# EAGLE schematic stream_i-o_2_3 (EAGLE 7.5.0)

## Sheet 1 of 2
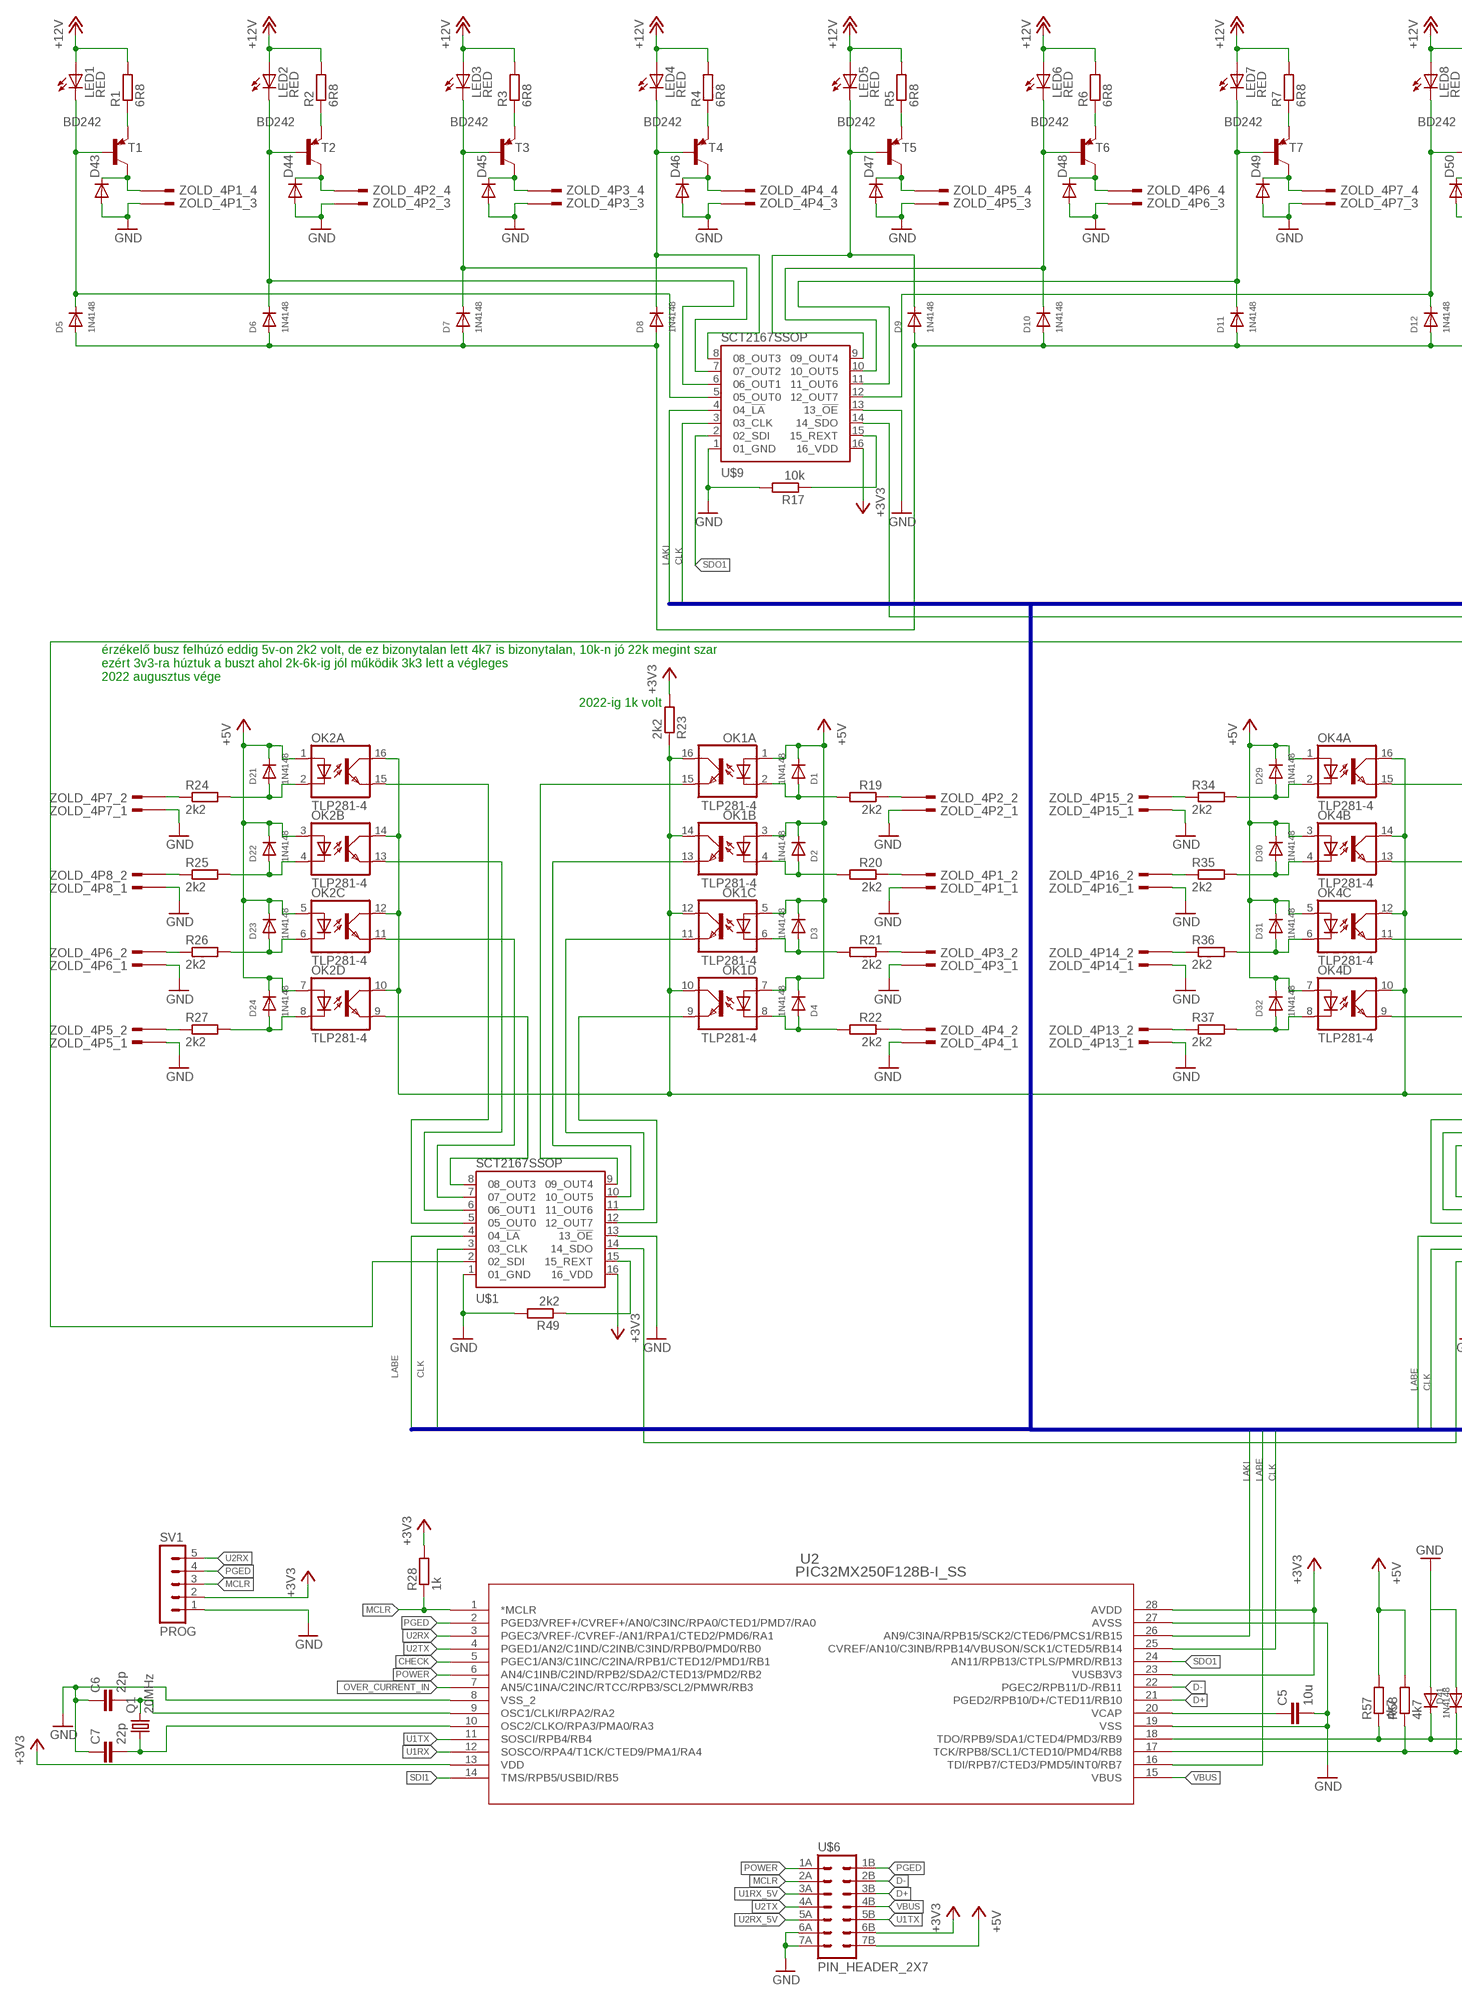
[diagram p0: schematic, sheet 1, part 1 of 2]
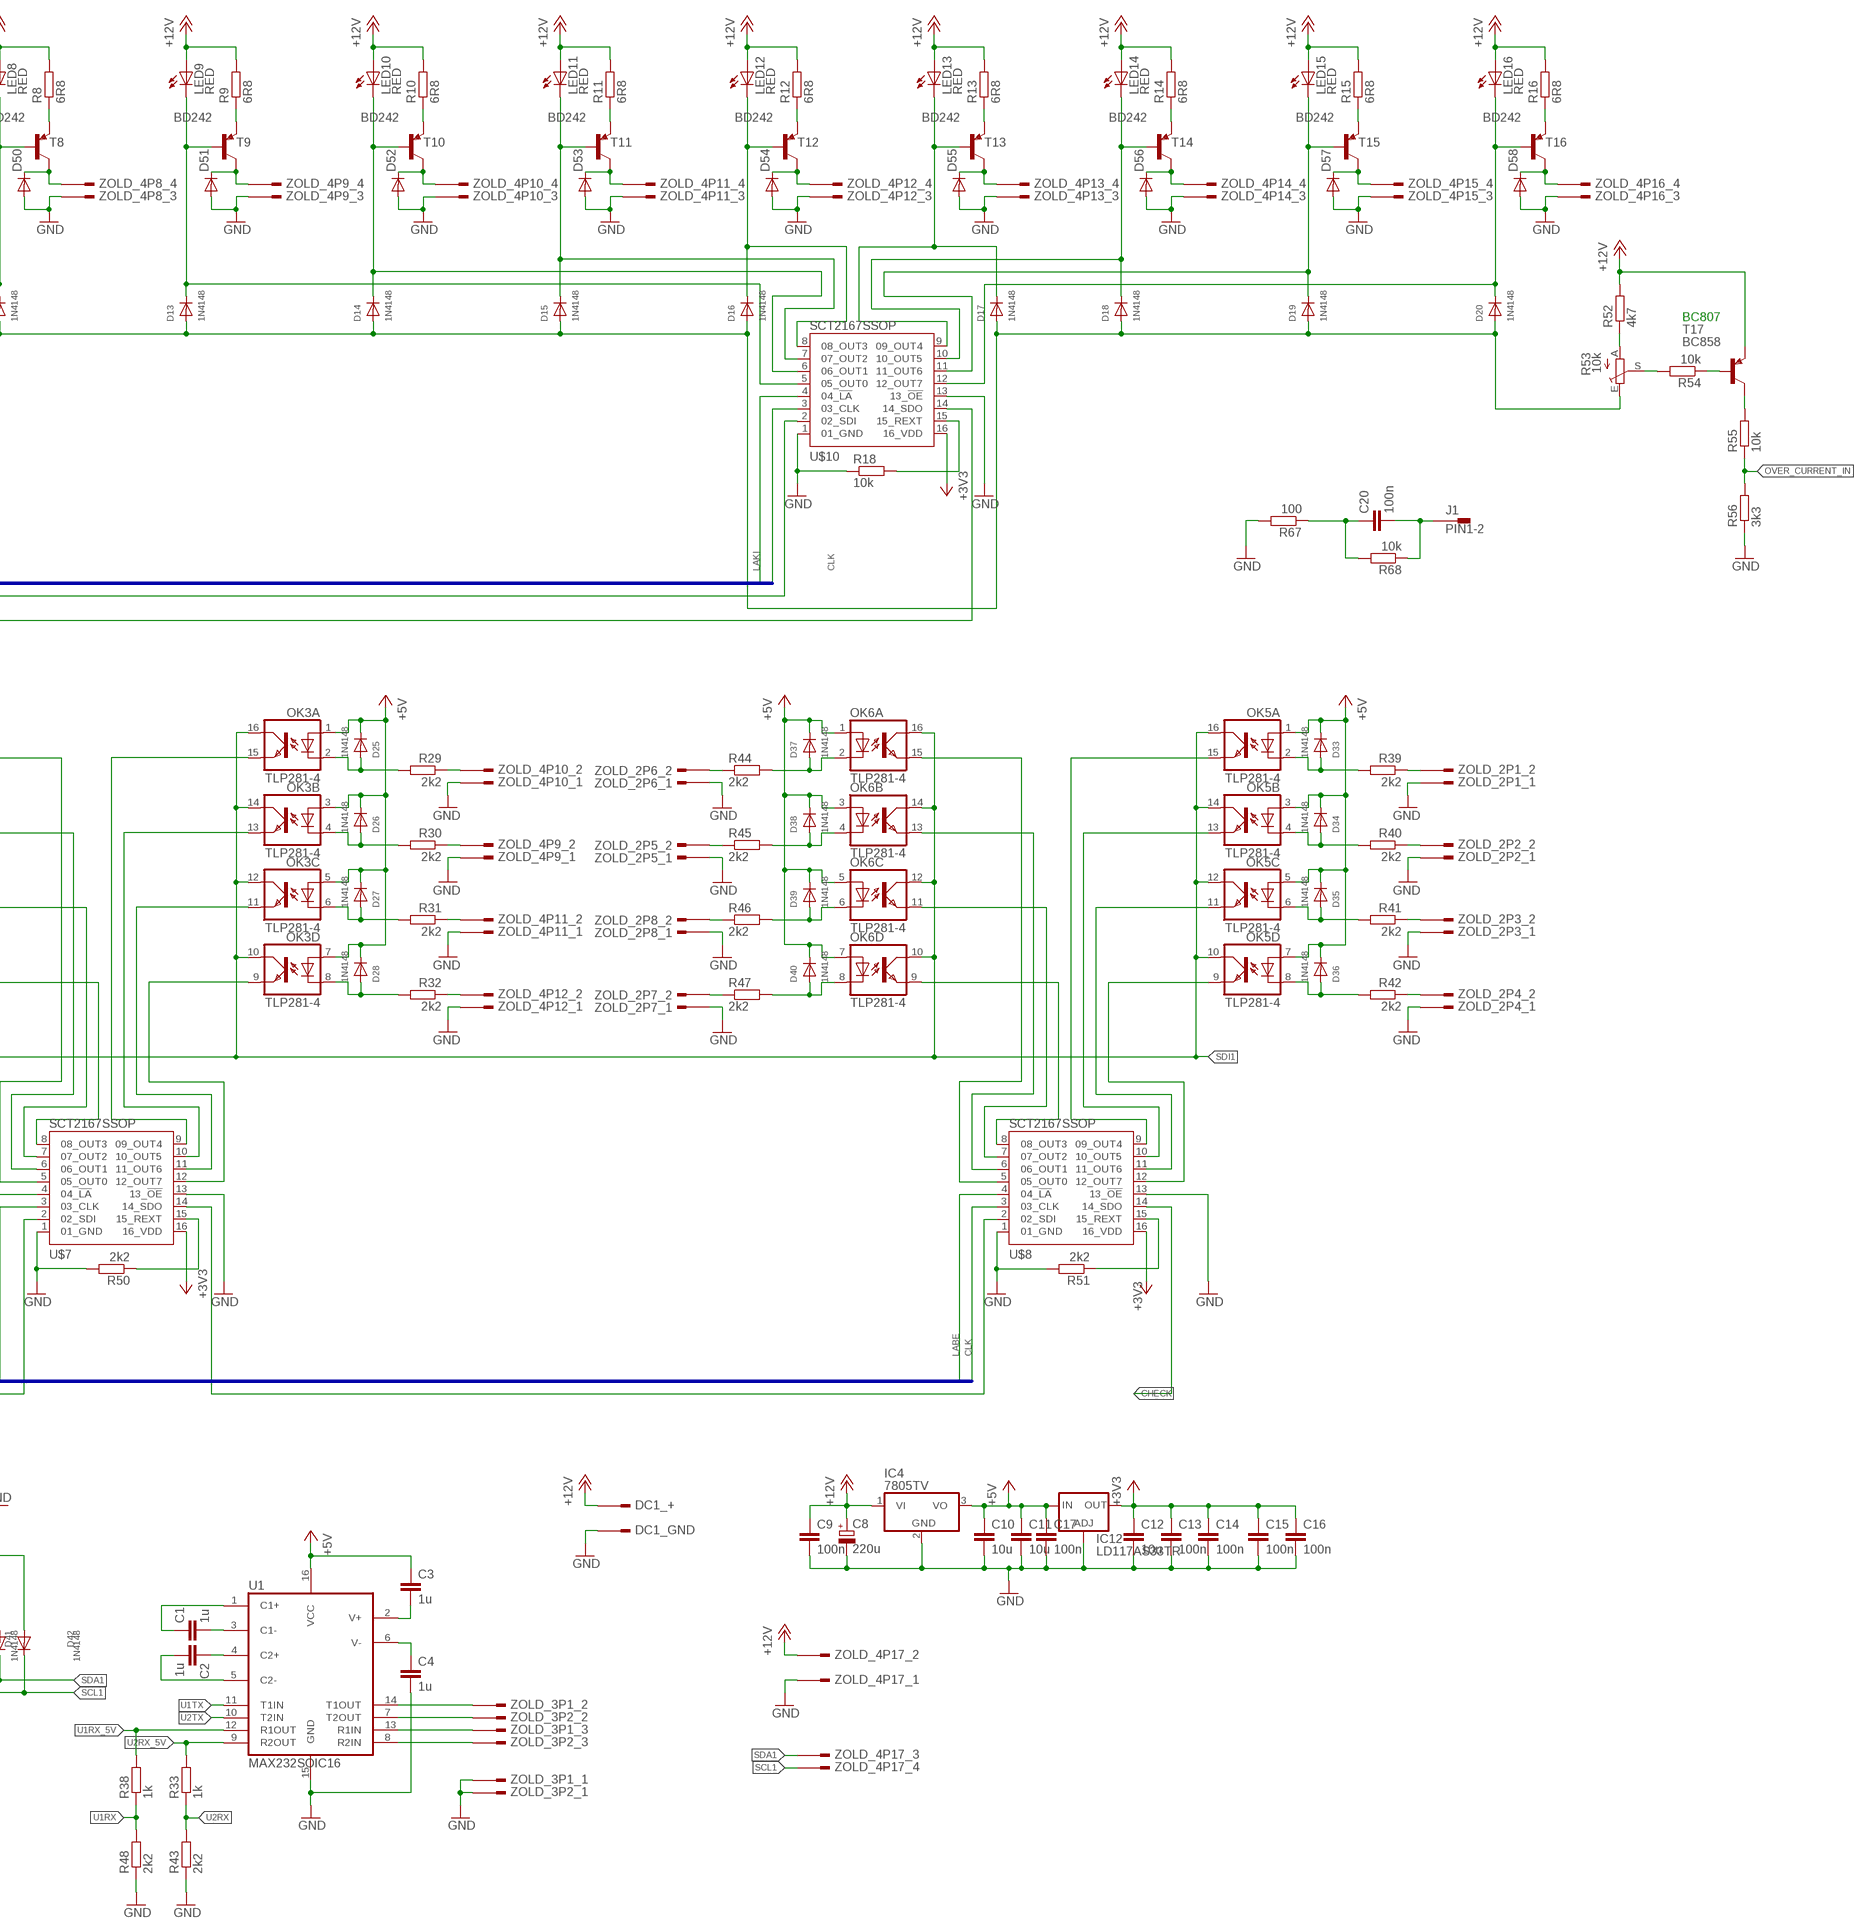
[diagram p1: schematic, sheet 1, part 2 of 2]

### Parts
C1  1u  C-EUC0805  [C0805]
C2  1u  C-EUC0805  [C0805]
C3  1u  C-EUC0805  [C0805]
C4  1u  C-EUC0805  [C0805]
C5  10u  C-EUC0805  [C0805]
C6  22p  C-EUC0805  [C0805]
C7  22p  C-EUC0805  [C0805]
C8  220u  CPOL-EUE2.5-7  [E2,5-7]
C9  100n  C-EUC0805  [C0805]
C10  10u  C-EUC0805  [C0805]
C11  10u  C-EUC0805  [C0805]
C12  10u  C-EUC0805  [C0805]
C13  100n  C-EUC0805  [C0805]
C14  100n  C-EUC0805  [C0805]
C15  100n  C-EUC0805  [C0805]
C16  100n  C-EUC0805  [C0805]
C17  100n  C-EUC0805  [C0805]
C20  100n  C-EUC0805  [C0805]
D1  1N4148  DIODESOD-323  [SOD-323]
D2  1N4148  DIODESOD-323  [SOD-323]
D3  1N4148  DIODESOD-323  [SOD-323]
D4  1N4148  DIODESOD-323  [SOD-323]
D5  1N4148  DIODESOD-323  [SOD-323]
D6  1N4148  DIODESOD-323  [SOD-323]
D7  1N4148  DIODESOD-323  [SOD-323]
D8  1N4148  DIODESOD-323  [SOD-323]
D9  1N4148  DIODESOD-323  [SOD-323]
D10  1N4148  DIODESOD-323  [SOD-323]
D11  1N4148  DIODESOD-323  [SOD-323]
D12  1N4148  DIODESOD-323  [SOD-323]
D13  1N4148  DIODESOD-323  [SOD-323]
D14  1N4148  DIODESOD-323  [SOD-323]
D15  1N4148  DIODESOD-323  [SOD-323]
D16  1N4148  DIODESOD-323  [SOD-323]
D17  1N4148  DIODESOD-323  [SOD-323]
D18  1N4148  DIODESOD-323  [SOD-323]
D19  1N4148  DIODESOD-323  [SOD-323]
D20  1N4148  DIODESOD-323  [SOD-323]
D21  1N4148  DIODESOD-323  [SOD-323]
D22  1N4148  DIODESOD-323  [SOD-323]
D23  1N4148  DIODESOD-323  [SOD-323]
D24  1N4148  DIODESOD-323  [SOD-323]
D25  1N4148  DIODESOD-323  [SOD-323]
D26  1N4148  DIODESOD-323  [SOD-323]
D27  1N4148  DIODESOD-323  [SOD-323]
D28  1N4148  DIODESOD-323  [SOD-323]
D29  1N4148  DIODESOD-323  [SOD-323]
D30  1N4148  DIODESOD-323  [SOD-323]
D31  1N4148  DIODESOD-323  [SOD-323]
D32  1N4148  DIODESOD-323  [SOD-323]
D33  1N4148  DIODESOD-323  [SOD-323]
D34  1N4148  DIODESOD-323  [SOD-323]
D35  1N4148  DIODESOD-323  [SOD-323]
D36  1N4148  DIODESOD-323  [SOD-323]
D37  1N4148  DIODESOD-323  [SOD-323]
D38  1N4148  DIODESOD-323  [SOD-323]
D39  1N4148  DIODESOD-323  [SOD-323]
D40  1N4148  DIODESOD-323  [SOD-323]
D41  1N4148  DIODESOD-323  [SOD-323]
D42  1N4148  DIODESOD-323  [SOD-323]
D43  DIODE-SOD-123  [SOD-123]
D44  DIODE-SOD-123  [SOD-123]
D45  DIODE-SOD-123  [SOD-123]
D46  DIODE-SOD-123  [SOD-123]
D47  DIODE-SOD-123  [SOD-123]
D48  DIODE-SOD-123  [SOD-123]
D49  DIODE-SOD-123  [SOD-123]
D50  DIODE-SOD-123  [SOD-123]
D51  DIODE-SOD-123  [SOD-123]
D52  DIODE-SOD-123  [SOD-123]
D53  DIODE-SOD-123  [SOD-123]
D54  DIODE-SOD-123  [SOD-123]
D55  DIODE-SOD-123  [SOD-123]
D56  DIODE-SOD-123  [SOD-123]
D57  DIODE-SOD-123  [SOD-123]
D58  DIODE-SOD-123  [SOD-123]
DC1  DC_55/21  [DC_55/21]
IC4  7805TV  [TO220V]
IC12  LD117AS33TR  [SOT223]
J1  PIN1-2  [62221]
LED1  RED  LEDCHIPLED_1206  [CHIPLED_1206]
LED2  RED  LEDCHIPLED_1206  [CHIPLED_1206]
LED3  RED  LEDCHIPLED_1206  [CHIPLED_1206]
LED4  RED  LEDCHIPLED_1206  [CHIPLED_1206]
LED5  RED  LEDCHIPLED_1206  [CHIPLED_1206]
LED6  RED  LEDCHIPLED_1206  [CHIPLED_1206]
LED7  RED  LEDCHIPLED_1206  [CHIPLED_1206]
LED8  RED  LEDCHIPLED_1206  [CHIPLED_1206]
LED9  RED  LEDCHIPLED_1206  [CHIPLED_1206]
LED10  RED  LEDCHIPLED_1206  [CHIPLED_1206]
LED11  RED  LEDCHIPLED_1206  [CHIPLED_1206]
LED12  RED  LEDCHIPLED_1206  [CHIPLED_1206]
LED13  RED  LEDCHIPLED_1206  [CHIPLED_1206]
LED14  RED  LEDCHIPLED_1206  [CHIPLED_1206]
LED15  RED  LEDCHIPLED_1206  [CHIPLED_1206]
LED16  RED  LEDCHIPLED_1206  [CHIPLED_1206]
OK1  TLP281-4  TLP283-4  [MINI-FLAT-16]
OK2  TLP281-4  TLP283-4  [MINI-FLAT-16]
OK3  TLP281-4  TLP283-4  [MINI-FLAT-16]
OK4  TLP281-4  TLP283-4  [MINI-FLAT-16]
OK5  TLP281-4  TLP283-4  [MINI-FLAT-16]
OK6  TLP281-4  TLP283-4  [MINI-FLAT-16]
Q1  20MHz  CRYSTALHC49UP  [HC49UP]
R1  6R8  R-EU_R0805  [R0805]
R2  6R8  R-EU_R0805  [R0805]
R3  6R8  R-EU_R0805  [R0805]
R4  6R8  R-EU_R0805  [R0805]
R5  6R8  R-EU_R0805  [R0805]
R6  6R8  R-EU_R0805  [R0805]
R7  6R8  R-EU_R0805  [R0805]
R8  6R8  R-EU_R0805  [R0805]
R9  6R8  R-EU_R0805  [R0805]
R10  6R8  R-EU_R0805  [R0805]
R11  6R8  R-EU_R0805  [R0805]
R12  6R8  R-EU_R0805  [R0805]
R13  6R8  R-EU_R0805  [R0805]
R14  6R8  R-EU_R0805  [R0805]
R15  6R8  R-EU_R0805  [R0805]
R16  6R8  R-EU_R0805  [R0805]
R17  10k  R-EU_R0805  [R0805]
R18  10k  R-EU_R0805  [R0805]
R19  2k2  R-EU_R0805  [R0805]
R20  2k2  R-EU_R0805  [R0805]
R21  2k2  R-EU_R0805  [R0805]
R22  2k2  R-EU_R0805  [R0805]
R23  2k2  R-EU_R0805  [R0805]
R24  2k2  R-EU_R0805  [R0805]
R25  2k2  R-EU_R0805  [R0805]
R26  2k2  R-EU_R0805  [R0805]
R27  2k2  R-EU_R0805  [R0805]
R28  1k  R-EU_R0805  [R0805]
R29  2k2  R-EU_R0805  [R0805]
R30  2k2  R-EU_R0805  [R0805]
R31  2k2  R-EU_R0805  [R0805]
R32  2k2  R-EU_R0805  [R0805]
R33  1k  R-EU_R0805  [R0805]
R34  2k2  R-EU_R0805  [R0805]
R35  2k2  R-EU_R0805  [R0805]
R36  2k2  R-EU_R0805  [R0805]
R37  2k2  R-EU_R0805  [R0805]
R38  1k  R-EU_R0805  [R0805]
R39  2k2  R-EU_R0805  [R0805]
R40  2k2  R-EU_R0805  [R0805]
R41  2k2  R-EU_R0805  [R0805]
R42  2k2  R-EU_R0805  [R0805]
R43  2k2  R-EU_R0805  [R0805]
R44  2k2  R-EU_R0805  [R0805]
R45  2k2  R-EU_R0805  [R0805]
R46  2k2  R-EU_R0805  [R0805]
R47  2k2  R-EU_R0805  [R0805]
R48  2k2  R-EU_R0805  [R0805]
R49  2k2  R-EU_R0805  [R0805]
R50  2k2  R-EU_R0805  [R0805]
R51  2k2  R-EU_R0805  [R0805]
R52  4k7  R-EU_R0805  [R0805]
R53  10k  TRIM_EU-PT-6  [PT-6]
R54  10k  R-EU_R0805  [R0805]
R55  10k  R-EU_R0805  [R0805]
R56  3k3  R-EU_R0805  [R0805]
R57  4k7  R-EU_R0805  [R0805]
R58  4k7  R-EU_R0805  [R0805]
R67  100  R-EU_R0805  [R0805]
R68  10k  R-EU_R0805  [R0805]
SV1  PROG  MA05-1  [MA05-1]
T1  BD242  -PNP-TO220V  [TO220V]
T2  BD242  -PNP-TO220V  [TO220V]
T3  BD242  -PNP-TO220V  [TO220V]
T4  BD242  -PNP-TO220V  [TO220V]
T5  BD242  -PNP-TO220V  [TO220V]
T6  BD242  -PNP-TO220V  [TO220V]
T7  BD242  -PNP-TO220V  [TO220V]
T8  BD242  -PNP-TO220V  [TO220V]
T9  BD242  -PNP-TO220V  [TO220V]
T10  BD242  -PNP-TO220V  [TO220V]
T11  BD242  -PNP-TO220V  [TO220V]
T12  BD242  -PNP-TO220V  [TO220V]
T13  BD242  -PNP-TO220V  [TO220V]
T14  BD242  -PNP-TO220V  [TO220V]
T15  BD242  -PNP-TO220V  [TO220V]
T16  BD242  -PNP-TO220V  [TO220V]
T17  BC858  BC858B-PNP-SOT23-BEC  [SOT23-BEC]
U1  MAX232SOIC16  [SO016]
U2  PIC32MX250F128B-I_SS  [SSOP28_MC]
U$1  SCT2167SSOP  [SSOP]
U$6  PIN_HEADER_2X7  [PIN_HEADER_2X7]
U$7  SCT2167SSOP  [SSOP]
U$8  SCT2167SSOP  [SSOP]
U$9  SCT2167SSOP  [SSOP]
U$10  SCT2167SSOP  [SSOP]
ZOLD_2P1  ZOLD_KICSI_2P  [ZOLD_KICSI_2P]
ZOLD_2P2  ZOLD_KICSI_2P  [ZOLD_KICSI_2P]
ZOLD_2P3  ZOLD_KICSI_2P  [ZOLD_KICSI_2P]
ZOLD_2P4  ZOLD_KICSI_2P  [ZOLD_KICSI_2P]
ZOLD_2P5  ZOLD_KICSI_2P  [ZOLD_KICSI_2P]
ZOLD_2P6  ZOLD_KICSI_2P  [ZOLD_KICSI_2P]
ZOLD_2P7  ZOLD_KICSI_2P  [ZOLD_KICSI_2P]
ZOLD_2P8  ZOLD_KICSI_2P  [ZOLD_KICSI_2P]
ZOLD_3P1  ZOLD_KICSI_3P  [ZOLD_KICSI_3P]
ZOLD_3P2  ZOLD_KICSI_3P  [ZOLD_KICSI_3P]
ZOLD_4P1  ZOLD_KICSI_4P  [ZOLD_KICSI_4P]
ZOLD_4P2  ZOLD_KICSI_4P  [ZOLD_KICSI_4P]
ZOLD_4P3  ZOLD_KICSI_4P  [ZOLD_KICSI_4P]
ZOLD_4P4  ZOLD_KICSI_4P  [ZOLD_KICSI_4P]
ZOLD_4P5  ZOLD_KICSI_4P  [ZOLD_KICSI_4P]
ZOLD_4P6  ZOLD_KICSI_4P  [ZOLD_KICSI_4P]
ZOLD_4P7  ZOLD_KICSI_4P  [ZOLD_KICSI_4P]
ZOLD_4P8  ZOLD_KICSI_4P  [ZOLD_KICSI_4P]
ZOLD_4P9  ZOLD_KICSI_4P  [ZOLD_KICSI_4P]
ZOLD_4P10  ZOLD_KICSI_4P  [ZOLD_KICSI_4P]
ZOLD_4P11  ZOLD_KICSI_4P  [ZOLD_KICSI_4P]
ZOLD_4P12  ZOLD_KICSI_4P  [ZOLD_KICSI_4P]
ZOLD_4P13  ZOLD_KICSI_4P  [ZOLD_KICSI_4P]
ZOLD_4P14  ZOLD_KICSI_4P  [ZOLD_KICSI_4P]
ZOLD_4P15  ZOLD_KICSI_4P  [ZOLD_KICSI_4P]
ZOLD_4P16  ZOLD_KICSI_4P  [ZOLD_KICSI_4P]
ZOLD_4P17  ZOLD_KICSI_4P  [ZOLD_KICSI_4P]

### Nets
+3V3: C12.1 C13.1 C14.1 C15.1 C16.1 IC12.4(OUT) R23.2 R28.2 SV1.2 U2.13(VDD) U2.23(VUSB3V3) U2.28(AVDD) U$1.16(16_VDD) U$6.6B U$7.16(16_VDD) U$8.16(16_VDD) U$9.16(16_VDD) U$10.16(16_VDD)
+5V: C3.1 C10.1 C11.1 C17.1 D1.C D2.C D3.C D4.C D21.C D22.C D23.C D24.C D25.C D26.C D27.C D28.C D29.C D30.C D31.C D32.C D33.C D34.C D35.C D36.C D37.C D38.C D39.C D40.C IC4.3(VO) IC12.3(IN) OK1.1(A:A) OK1.3(B:A) OK1.5(C:A) OK1.7(D:A) OK2.1(A:A) OK2.3(B:A) OK2.5(C:A) OK2.7(D:A) OK3.1(A:A) OK3.3(B:A) OK3.5(C:A) OK3.7(D:A) OK4.1(A:A) OK4.3(B:A) OK4.5(C:A) OK4.7(D:A) OK5.1(A:A) OK5.3(B:A) OK5.5(C:A) OK5.7(D:A) OK6.1(A:A) OK6.3(B:A) OK6.5(C:A) OK6.7(D:A) R57.2 R58.2 U1.16(VCC) U$6.7B
+12V: C8.+ C9.1 DC1.2 IC4.1(VI) LED1.A LED2.A LED3.A LED4.A LED5.A LED6.A LED7.A LED8.A LED9.A LED10.A LED11.A LED12.A LED13.A LED14.A LED15.A LED16.A R1.2 R2.2 R3.2 R4.2 R5.2 R6.2 R7.2 R8.2 R9.2 R10.2 R11.2 R12.2 R13.2 R14.2 R15.2 R16.2 R52.2 T17.E ZOLD_4P17.2
CHECK: U2.5(PGEC1/AN3/C1INC/C2INA/RPB1/CTED12/PMD1/RB1) U$8.14(14_SDO)
CLK: U2.25(CVREF/AN10/C3INB/RPB14/VBUSON/SCK1/CTED5/RB14) U$1.3(03_CLK) U$7.3(03_CLK) U$8.3(03_CLK) U$9.3(03_CLK) U$10.3(03_CLK)
D+: U2.21(PGED2/RPB10/D+/CTED11/RB10) U$6.3B
D-: U2.22(PGEC2/RPB11/D-/RB11) U$6.2B
LABE: U2.16(TDI/RPB7/CTED3/PMD5/INT0/RB7) U$1.4(04_!LA!) U$7.4(04_!LA!) U$8.4(04_!LA!)
LAKI: U2.26(AN9/C3INA/RPB15/SCK2/CTED6/PMCS1/RB15) U$9.4(04_!LA!) U$10.4(04_!LA!)
MCLR: R28.1 SV1.3 U2.1(*MCLR) U$6.2A
N$1: D8.C LED4.C T4.1(B) U$9.8(08_OUT3)
N$2: D5.C LED1.C T1.1(B) U$9.5(05_OUT0)
N$3: R1.1 T1.3(E)
N$4: D43.C T1.2(C) ZOLD_4P1.4
N$5: D6.C LED2.C T2.1(B) U$9.6(06_OUT1)
N$6: R2.1 T2.3(E)
N$7: D44.C T2.2(C) ZOLD_4P2.4
N$8: D7.C LED3.C T3.1(B) U$9.7(07_OUT2)
N$9: R3.1 T3.3(E)
N$10: D45.C T3.2(C) ZOLD_4P3.4
N$11: R4.1 T4.3(E)
N$12: D46.C T4.2(C) ZOLD_4P4.4
N$13: D9.C LED5.C T5.1(B) U$9.9(09_OUT4)
N$14: R5.1 T5.3(E)
N$15: D47.C T5.2(C) ZOLD_4P5.4
N$16: D10.C LED6.C T6.1(B) U$9.10(10_OUT5)
N$17: R6.1 T6.3(E)
N$18: D48.C T6.2(C) ZOLD_4P6.4
N$19: D11.C LED7.C T7.1(B) U$9.11(11_OUT6)
N$20: R7.1 T7.3(E)
N$21: D49.C T7.2(C) ZOLD_4P7.4
N$22: D12.C LED8.C T8.1(B) U$9.12(12_OUT7)
N$23: R8.1 T8.3(E)
N$24: D50.C T8.2(C) ZOLD_4P8.4
N$25: R49.1 U$1.15(15_REXT)
N$26: C4.2 C5.2 C6.1 C7.1 C8.- C9.2 C10.2 C11.2 C12.2 C13.2 C14.2 C15.2 C16.2 C17.2 D41.A D42.A D43.A D44.A D45.A D46.A D47.A D48.A D49.A D50.A D51.A D52.A D53.A D54.A D55.A D56.A D57.A D58.A DC1.1 IC4.2(GND) IC12.1(ADJ) R17.2 R18.1 R43.1 R48.1 R49.2 R50.2 R51.2 R56.1 R67.2 SV1.1 U1.15(GND) U2.8(VSS_2) U2.19(VSS) U2.27(AVSS) U$1.1(01_GND) U$1.13(13_!OE!) U$6.6A U$6.7A U$7.1(01_GND) U$7.13(13_!OE!) U$8.1(01_GND) U$8.13(13_!OE!) U$9.1(01_GND) U$9.13(13_!OE!) U$10.1(01_GND) U$10.13(13_!OE!) ZOLD_2P1.1 ZOLD_2P2.1 ZOLD_2P3.1 ZOLD_2P4.1 ZOLD_2P5.1 ZOLD_2P6.1 ZOLD_2P7.1 ZOLD_2P8.1 ZOLD_3P1.1 ZOLD_3P2.1 ZOLD_4P1.1 ZOLD_4P1.3 ZOLD_4P2.1 ZOLD_4P2.3 ZOLD_4P3.1 ZOLD_4P3.3 ZOLD_4P4.1 ZOLD_4P4.3 ZOLD_4P5.1 ZOLD_4P5.3 ZOLD_4P6.1 ZOLD_4P6.3 ZOLD_4P7.1 ZOLD_4P7.3 ZOLD_4P8.1 ZOLD_4P8.3 ZOLD_4P9.1 ZOLD_4P9.3 ZOLD_4P10.1 ZOLD_4P10.3 ZOLD_4P11.1 ZOLD_4P11.3 ZOLD_4P12.1 ZOLD_4P12.3 ZOLD_4P13.1 ZOLD_4P13.3 ZOLD_4P14.1 ZOLD_4P14.3 ZOLD_4P15.1 ZOLD_4P15.3 ZOLD_4P16.1 ZOLD_4P16.3 ZOLD_4P17.1 ; supply symbol labelled GND
N$27: U$9.14(14_SDO) U$10.2(02_SDI)
N$28: R20.1 ZOLD_4P1.2
N$29: D1.A OK1.2(A:C) R19.2
N$30: R19.1 ZOLD_4P2.2
N$31: D2.A OK1.4(B:C) R20.2
N$32: R21.1 ZOLD_4P3.2
N$33: D13.C LED9.C T9.1(B) U$10.5(05_OUT0)
N$34: R9.1 T9.3(E)
N$35: D51.C T9.2(C) ZOLD_4P9.4
N$36: D14.C LED10.C T10.1(B) U$10.6(06_OUT1)
N$37: R10.1 T10.3(E)
N$38: D52.C T10.2(C) ZOLD_4P10.4
N$39: D15.C LED11.C T11.1(B) U$10.7(07_OUT2)
N$40: R11.1 T11.3(E)
N$41: D53.C T11.2(C) ZOLD_4P11.4
N$42: D16.C LED12.C T12.1(B) U$10.8(08_OUT3)
N$43: R12.1 T12.3(E)
N$44: D54.C T12.2(C) ZOLD_4P12.4
N$45: D17.C LED13.C T13.1(B) U$10.9(09_OUT4)
N$46: R13.1 T13.3(E)
N$47: D55.C T13.2(C) ZOLD_4P13.4
N$48: D18.C LED14.C T14.1(B) U$10.10(10_OUT5)
N$49: R14.1 T14.3(E)
N$50: D56.C T14.2(C) ZOLD_4P14.4
N$51: D19.C LED15.C T15.1(B) U$10.11(11_OUT6)
N$52: R15.1 T15.3(E)
N$53: D57.C T15.2(C) ZOLD_4P15.4
N$54: D20.C LED16.C T16.1(B) U$10.12(12_OUT7)
N$55: R16.1 T16.3(E)
N$56: D58.C T16.2(C) ZOLD_4P16.4
N$57: D3.A OK1.6(C:C) R21.2
N$58: R22.1 ZOLD_4P4.2
N$59: D4.A OK1.8(D:C) R22.2
N$60: R35.1 ZOLD_4P16.2
N$61: D5.A D6.A D7.A D8.A D9.A D10.A D11.A D12.A D13.A D14.A D15.A D16.A D17.A D18.A D19.A D20.A R53.E
N$62: D25.A OK3.2(A:C) R29.2
N$63: D26.A OK3.4(B:C) R30.2
N$64: OK1.15(A:EMIT) U$1.9(09_OUT4)
N$65: OK1.13(B:EMIT) U$1.10(10_OUT5)
N$66: OK1.11(C:EMIT) U$1.11(11_OUT6)
N$67: OK1.9(D:EMIT) U$1.12(12_OUT7)
N$68: D21.A OK2.2(A:C) R24.2
N$69: D22.A OK2.4(B:C) R25.2
N$70: D23.A OK2.6(C:C) R26.2
N$71: D24.A OK2.8(D:C) R27.2
N$72: R25.1 ZOLD_4P8.2
N$73: R24.1 ZOLD_4P7.2
N$74: R26.1 ZOLD_4P6.2
N$75: R27.1 ZOLD_4P5.2
N$76: OK5.15(A:EMIT) U$8.9(09_OUT4)
N$77: OK2.15(A:EMIT) U$1.5(05_OUT0)
N$78: OK2.13(B:EMIT) U$1.6(06_OUT1)
N$79: OK2.11(C:EMIT) U$1.7(07_OUT2)
N$80: OK2.9(D:EMIT) U$1.8(08_OUT3)
N$81: D27.A OK3.6(C:C) R31.2
N$82: D28.A OK3.8(D:C) R32.2
N$83: R30.1 ZOLD_4P9.2
N$84: R29.1 ZOLD_4P10.2
N$85: R31.1 ZOLD_4P11.2
N$86: R32.1 ZOLD_4P12.2
N$87: R34.1 ZOLD_4P15.2
N$88: OK3.15(A:EMIT) U$7.9(09_OUT4)
N$89: OK3.13(B:EMIT) U$7.10(10_OUT5)
N$90: OK3.11(C:EMIT) U$7.11(11_OUT6)
N$91: OK3.9(D:EMIT) U$7.12(12_OUT7)
N$92: D29.A OK4.2(A:C) R34.2
N$93: D30.A OK4.4(B:C) R35.2
N$94: D31.A OK4.6(C:C) R36.2
N$95: D32.A OK4.8(D:C) R37.2
N$96: OK5.13(B:EMIT) U$8.10(10_OUT5)
N$97: OK4.13(B:EMIT) U$7.6(06_OUT1)
N$98: R36.1 ZOLD_4P14.2
N$99: R37.1 ZOLD_4P13.2
N$100: OK5.11(C:EMIT) U$8.11(11_OUT6)
N$101: OK4.15(A:EMIT) U$7.5(05_OUT0)
N$102: R50.1 U$7.15(15_REXT)
N$103: OK4.11(C:EMIT) U$7.7(07_OUT2)
N$104: OK4.9(D:EMIT) U$7.8(08_OUT3)
N$105: D33.A OK5.2(A:C) R39.2
N$106: D34.A OK5.4(B:C) R40.2
N$107: D35.A OK5.6(C:C) R41.2
N$108: D36.A OK5.8(D:C) R42.2
N$109: R39.1 ZOLD_2P1.2
N$110: R40.1 ZOLD_2P2.2
N$111: R41.1 ZOLD_2P3.2
N$112: R42.1 ZOLD_2P4.2
N$113: OK5.9(D:EMIT) U$8.12(12_OUT7)
N$114: R45.1 ZOLD_2P5.2
N$115: R47.1 ZOLD_2P7.2
N$116: R44.1 ZOLD_2P6.2
N$117: R46.1 ZOLD_2P8.2
N$118: D37.A OK6.2(A:C) R44.2
N$119: D38.A OK6.4(B:C) R45.2
N$120: D39.A OK6.6(C:C) R46.2
N$121: D40.A OK6.8(D:C) R47.2
N$122: C1.2 U1.3(C1-)
N$123: C1.1 U1.1(C1+)
N$124: C2.1 U1.4(C2+)
N$125: C2.2 U1.5(C2-)
N$126: C3.2 U1.2(V+)
N$127: OK6.15(A:EMIT) U$8.5(05_OUT0)
N$128: OK6.13(B:EMIT) U$8.6(06_OUT1)
N$129: OK6.11(C:EMIT) U$8.7(07_OUT2)
N$130: OK6.9(D:EMIT) U$8.8(08_OUT3)
N$132: R51.1 U$8.15(15_REXT)
N$134: U$1.2(02_SDI) U$10.14(14_SDO)
N$135: U$1.14(14_SDO) U$7.2(02_SDI)
N$136: U$7.14(14_SDO) U$8.2(02_SDI)
N$137: U1.14(T1OUT) ZOLD_3P1.2
N$138: C4.1 U1.6(V-)
N$139: U1.13(R1IN) ZOLD_3P1.3
N$140: U1.7(T2OUT) ZOLD_3P2.2
N$141: U1.8(R2IN) ZOLD_3P2.3
N$142: C5.1 U2.20(VCAP)
N$143: C20.1 R67.1 R68.2
N$144: R52.1 R53.A
N$145: R53.S R54.2
N$146: R54.1 T17.B
N$147: C20.2 J1.1 R68.1
N$148: R55.2 T17.C
N$151: C7.2 Q1.1 U2.10(OSC2/CLKO/RPA3/PMA0/RA3)
N$152: C6.2 Q1.2 U2.9(OSC1/CLKI/RPA2/RA2)
N$156: R17.1 U$9.15(15_REXT)
N$171: R18.2 U$10.15(15_REXT)
OVER_CURRENT_IN: R55.1 R56.2 U2.7(AN5/C1INA/C2INC/RTCC/RPB3/SCL2/PMWR/RB3)
PGED: SV1.4 U2.2(PGED3/VREF+/CVREF+/AN0/C3INC/RPA0/CTED1/PMD7/RA0) U$6.1B
POWER: U2.6(AN4/C1INB/C2IND/RPB2/SDA2/CTED13/PMD2/RB2) U$6.1A
SCL1: D42.C R58.1 U2.17(TCK/RPB8/SCL1/CTED10/PMD4/RB8) ZOLD_4P17.4
SDA1: D41.C R57.1 U2.18(TDO/RPB9/SDA1/CTED4/PMD3/RB9) ZOLD_4P17.3
SDI1: OK1.10(D:COL) OK1.12(C:COL) OK1.14(B:COL) OK1.16(A:COL) OK2.10(D:COL) OK2.12(C:COL) OK2.14(B:COL) OK2.16(A:COL) OK3.10(D:COL) OK3.12(C:COL) OK3.14(B:COL) OK3.16(A:COL) OK4.10(D:COL) OK4.12(C:COL) OK4.14(B:COL) OK4.16(A:COL) OK5.10(D:COL) OK5.12(C:COL) OK5.14(B:COL) OK5.16(A:COL) OK6.10(D:COL) OK6.12(C:COL) OK6.14(B:COL) OK6.16(A:COL) R23.1 U2.14(TMS/RPB5/USBID/RB5)
SDO1: U2.24(AN11/RPB13/CTPLS/PMRD/RB13) U$9.2(02_SDI)
U1RX: R38.1 R48.2 U2.12(SOSCO/RPA4/T1CK/CTED9/PMA1/RA4)
U1RX_5V: R38.2 U1.12(R1OUT) U$6.3A
U1TX: U1.11(T1IN) U2.11(SOSCI/RPB4/RB4) U$6.5B
U2RX: R33.1 R43.2 SV1.5 U2.3(PGEC3/VREF-/CVREF-/AN1/RPA1/CTED2/PMD6/RA1)
U2RX_5V: R33.2 U1.9(R2OUT) U$6.5A
U2TX: U1.10(T2IN) U2.4(PGED1/AN2/C1IND/C2INB/C3IND/RPB0/PMD0/RB0) U$6.4A
VBUS: U2.15(VBUS) U$6.4B

### Buses
CLK,LAKI,LABE

### Notes on the sheet
- BC807
- érzékelő busz felhúzó eddig 5v-on 2k2 volt, de ez bizonytalan lett 4k7 is bizonytalan, 10k-n jó 22k megint szar
  ezért 3v3-ra húztuk a buszt ahol 2k-6k-ig jól működik 3k3 lett a végleges
  2022 augusztus vége
- 2022-ig 1k volt

## Sheet 2 of 2
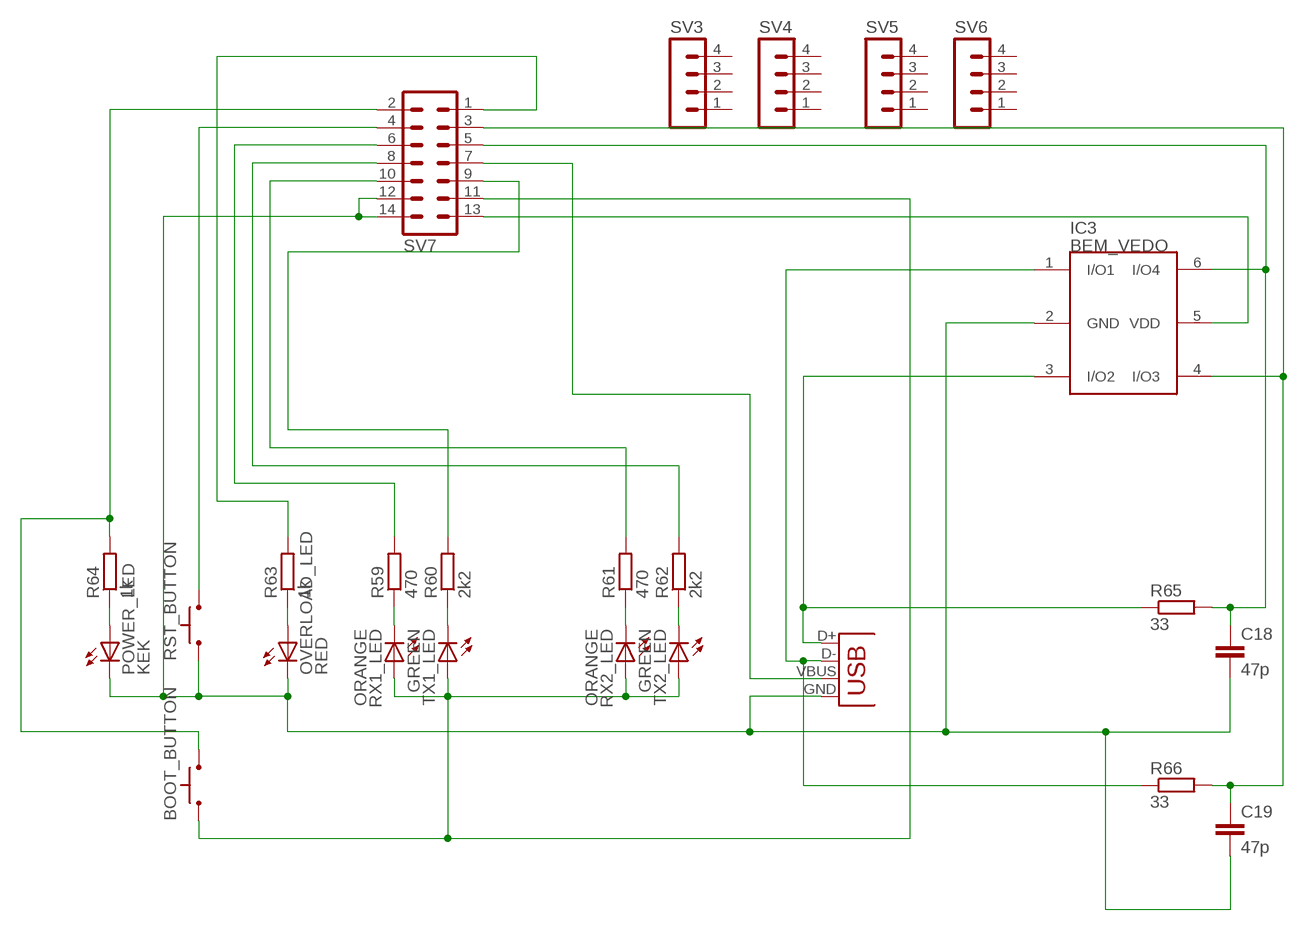
[diagram p2: schematic, sheet 2]

### Parts
BOOT_BUTTON  BUTTONRACON12  [RACON12]
C18  47p  C-EUC0805  [C0805]
C19  47p  C-EUC0805  [C0805]
IC3  BEM_VEDO  [TSOP-6]
JP1  USBPTH-VERTICAL  [USB-B-PTH-VERTICAL]
OVERLOAD_LED  RED  LED5MM  [LED5MM]
POWER_LED  KEK  LED5MM  [LED5MM]
R59  470  R-EU_R0805  [R0805]
R60  2k2  R-EU_R0805  [R0805]
R61  470  R-EU_R0805  [R0805]
R62  2k2  R-EU_R0805  [R0805]
R63  1k  R-EU_R0805  [R0805]
R64  1k  R-EU_R0805  [R0805]
R65  33  R-EU_R0805  [R0805]
R66  33  R-EU_R0805  [R0805]
RST_BUTTON  BUTTONRACON12  [RACON12]
RX1_LED  ORANGE  LED5MM  [LED5MM]
RX2_LED  ORANGE  LED5MM  [LED5MM]
SV3  MA04-1  [MA04-1]
SV4  MA04-1  [MA04-1]
SV5  MA04-1  [MA04-1]
SV6  MA04-1  [MA04-1]
SV7  MA07-2  [MA07-2]
TX1_LED  GREEN  LED5MM  [LED5MM]
TX2_LED  GREEN  LED5MM  [LED5MM]

### Nets
N$149: R59.1 RX1_LED.K(C)
N$150: R60.1 TX1_LED.K(C)
N$153: R61.1 RX2_LED.K(C)
N$154: IC3.5(VDD) SV7.13
N$155: R62.1 TX2_LED.K(C)
N$159: RST_BUTTON.3(S) RST_BUTTON.4(S) SV7.4
N$160: R59.2 SV7.6
N$161: R60.2 SV7.9
N$162: R61.2 SV7.10
N$163: R62.2 SV7.8
N$164: C18.2 C19.2 IC3.2(GND) JP1.GND OVERLOAD_LED.K(C) POWER_LED.K(C) RST_BUTTON.1(P) RST_BUTTON.2(P) SV7.12 SV7.14
N$165: POWER_LED.A R64.1
N$166: OVERLOAD_LED.A R63.1
N$167: IC3.3(I/O2) JP1.D+ R65.1
N$168: BOOT_BUTTON.3(S) BOOT_BUTTON.4(S) R64.2 SV7.2
N$169: R63.2 SV7.1
N$172: C18.1 IC3.6(I/O4) R65.2 SV7.5
N$173: JP1.VBUS SV7.7
N$174: C19.1 IC3.4(I/O3) R66.2 SV7.3
N$176: IC3.1(I/O1) JP1.D- R66.1
N$180: BOOT_BUTTON.1(P) BOOT_BUTTON.2(P) RX1_LED.A RX2_LED.A SV7.11 TX1_LED.A TX2_LED.A
Unconnected: SV3.1 SV3.2 SV3.3 SV3.4 SV4.1 SV4.2 SV4.3 SV4.4 SV5.1 SV5.2 SV5.3 SV5.4 SV6.1 SV6.2 SV6.3 SV6.4

## Library data of the parts
BOOT_BUTTON RST_BUTTON = Cf_Egyeb:BUTTON: ITT SWITCH
C1-C7 C9-C20 = rcl:C-EU: CAPACITOR, European symbol
C8 = rcl:CPOL-EU: POLARIZED CAPACITOR, European symbol
D1-D42 = microbuilder:DIODE: Diode SMA Model Volts Amps Type Vf Vr Digikey # Notes SSA34-E3 40V 3A Schottky 480mV @ 3A 200uA @ 40V SSA34-E3/61TGITR-ND CDBA120-G 20V 1A Schottky 500mV @ 1A 500uA @ 20V 641-1014-6-ND REEL MBRA210 10V 2A Schottky 350mV @ 2A 700uA @ 10V MBRA210LT3 SOD-123 Model Volts Amps Type Vf Vr Order # Notes BAT54T1G 30V 200mA Schottky 800mV @ 200mA 2uA @ 25V BAT54T1GOSTR-ND B0530W 30V 500mA Schottky 430mV @ 500mA 130uA @ 30V B0530W-FDICT-ND REEL MBR120 1A 20V Schottky 340mV @ 1A MBR120VLSFT1GOSCT-ND SOD-323 Model Volts Amps Type Vf Vr Order # Notes PMEG2005EJ 20V 500mA Schottky 355mV @ 500mA 568-4110-1-ND ZLLS410 10V 570mA Schottky 380mV @ 570mA ZLLS410CT-ND 1N4148WS 75V 150mA Silicon/Simple 1V 1N4148WSFSCT-ND REEL SOD-523 Model Volts Amps Type Vf Vr Order # Notes BAT54XV2 30V 200mA Schottky 0.8V @ 100mA BAT54XV2CT-ND TB751S 30V 30mA Schottky RB751S-40TE61CT-ND SOT23-R/W (R = Solder Paste/Reflow Ovens, W = Hand-Soldering) Model Volts Amps Type Vf Vr Order # Notes BAT54FILM 40V 300mA Schottky 497-7162-1-ND
D43-D58 = dp_devices:DIODE: Various Diode Packages
DC1 = narval:DC_55/21
IC3 = narval:BEM_VEDO
IC4 = linear:78*: Positive VOLTAGE REGULATOR Source: http://cache.national.com/ds/LM/LM78L05.pdf http://www.fairchildsemi.com/ds/LM/LM7805.pdf
IC12 = v-reg:LD117A?*: Low drop fixed and adjustable positive voltage regulators 1 A Source: http://www.st.com/stonline/products/literature/ds/7194/ld1117axx.pdf
J1 = con-faston:PIN1-2: CONN TAB FASTON BRASS .187 PCB TAB, FSSTON, DUAL STAKE, .187 SERIES Digi-Key Part Number: A24734CT-ND Source: Tyco Electronics Corporation .. ENG_CD_62221_R.pdf http://search.digikey.com/scripts/DkSearch/dksus.dll?Detail&name=A24734CT-ND; MF: TYCO ELECTRONICS; MPN: 62221-1; OC_FARNELL: unknown; OC_NEWARK: 16H2318
JP1 = SparkFun-Connectors:USB: USB Connectors USB-B-PTH is fully proven SKU : PRT-00139/CONN-08278 USB-miniB is fully proven SKU : PRT-00587 USB-A-PCB is untested. USB-A-H is throughly reviewed, but untested. Spark Fun Electronics SKU : PRT-00437 USB-B-SMT is throughly reviewed, but untested. Needs silkscreen touching up. USB-A-S has not been used/tested USB-MB-H has not been used/tested USB-MICROB has been used. CONN-09505
LED1-LED16 OVERLOAD_LED POWER_LED RX1_LED RX2_LED TX1_LED TX2_LED = led:LED: LED OSRAM: - CHIPLED LG R971, LG N971, LY N971, LG Q971, LY Q971, LO R971, LY R971 LH N974, LH R974 LS Q976, LO Q976, LY Q976 LO Q996 - Hyper CHIPLED LW Q18S LB Q993, LB Q99A, LB R99A - SideLED LS A670, LO A670, LY A670, LG A670, LP A670 LB A673, LV A673, LT A673, LW A673 LH A674 LY A675 LS A676, LA A676, LO A676, LY A676, LW A676 LS A679, LY A679, LG A679 - Hyper Micro SIDELED® LS Y876, LA Y876, LO Y876, LY Y876 LT Y87S - SmartLED LW L88C, LW L88S LB L89C, LB L89S, LG L890 LS L89K, LO L89K, LY L89K LS L896, LA L896, LO L896, LY L896 - TOPLED LS T670, LO T670, LY T670, LG T670, LP T670 LSG T670, LSP T670, LSY T670, LOP T670, LYG T670 LG T671, LOG T671, LSG T671 LB T673, LV T673, LT T673, LW T673 LH T674 LS T676, LA T676, LO T676, LY T676, LB T676, LH T676, LSB T676, LW T676 LB T67C, LV T67C, LT T67C, LS T67K, LO T67K, LY T67K, LW E67C LS E67B, LA E67B, LO E67B, LY E67B, LB E67C, LV E67C, LT E67C LW T67C LS T679, LY T679, LG T679 LS T770, LO T770, LY T770, LG T770, LP T770 LB T773, LV T773, LT T773, LW T773 LH T774 LS E675, LA E675, LY E675, LS T675 LS T776, LA T776, LO T776, LY T776, LB T776 LHGB T686 LT T68C, LB T68C - Hyper Mini TOPLED® LB M676 - Mini TOPLED Santana® LG M470 LS M47K, LO M47K, LY M47K Source: http://www.osram.convergy.de LUXEON: - LUMILED® LXK2-PW12-R00, LXK2-PW12-S00, LXK2-PW14-U00, LXK2-PW14-V00 LXK2-PM12-R00, LXK2-PM12-S00, LXK2-PM14-U00 LXK2-PE12-Q00, LXK2-PE12-R00, LXK2-PE12-S00, LXK2-PE14-T00, LXK2-PE14-U00 LXK2-PB12-K00, LXK2-PB12-L00, LXK2-PB12-M00, LXK2-PB14-N00, LXK2-PB14-P00, LXK2-PB14-Q00 LXK2-PR12-L00, LXK2-PR12-M00, LXK2-PR14-Q00, LXK2-PR14-R00 LXK2-PD12-Q00, LXK2-PD12-R00, LXK2-PD12-S00 LXK2-PH12-R00, LXK2-PH12-S00 LXK2-PL12-P00, LXK2-PL12-Q00, LXK2-PL12-R00 Source: www.luxeon.com KINGBRIGHT: KA-3528ASYC Source: www.kingbright.com
OK1-OK6 = optocoupler:TLP283-4: TOSHIBA PHOTOCOUPLER GaAs IRED & PHOTO-TRANSISTOR Source: http://www.semicon.toshiba.co.jp/td/en/Opto/Photocoupler/en_20050928_TLP283_datasheet.pdf; OC_FARNELL: unknown; OC_NEWARK: unknown
Q1 = crystal:CRYSTAL: CRYSTAL; OC_FARNELL: unknown; OC_NEWARK: unknown
R1-R52 R54-R68 = rcl:R-EU_: RESISTOR, European symbol
R53 = pot:TRIM_EU-: POTENTIOMETER
SV1 = con-lstb:MA05-1: PIN HEADER; OC_FARNELL: unknown; OC_NEWARK: unknown
SV3-SV6 = con-lstb:MA04-1: PIN HEADER; OC_FARNELL: unknown; OC_NEWARK: unknown
SV7 = con-lstb:MA07-2: PIN HEADER; OC_FARNELL: unknown; OC_NEWARK: unknown
T1-T17 = transistor:*-PNP-: PNP Transistror
U1 = SparkFun-DigitalIC:MAX232: RS232 Transceiver Very common IC. This is generically called 'MAX232', but works with the 3V equivalent MAX3232 generic ICs. Field tested and mother approved. Spark Fun Electronics SKU : COM-00316 (DIP) and COM-00589 (SMD)
U2 = microchip_pic32:PIC32MX250F128B-I_SS
U$1 U$7-U$10 = SCT2167:SCT2167
U$6 = narval:PIN_HEADER_2X7
ZOLD_2P1-ZOLD_2P8 = narval:ZOLD_KICSI_2P
ZOLD_3P1 ZOLD_3P2 = narval:ZOLD_KICSI_3P
ZOLD_4P1-ZOLD_4P17 = narval:ZOLD_KICSI_4P

## Net classes
0 default: width 0.203 mm, clearance 0.203 mm